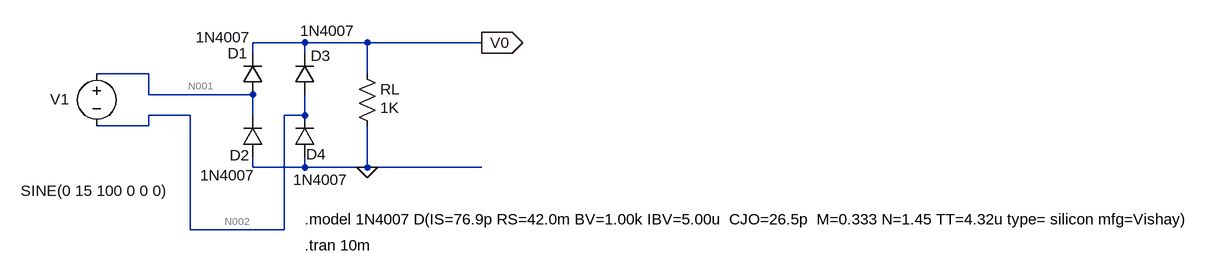
[diagram p0: schematic Bridge.asc]
Bridge.asc, the LTspice schematic file:
Version 4
SHEET 1 1500 680
WIRE 112 96 32 96
WIRE 208 96 112 96
WIRE 384 96 208 96
WIRE 32 112 32 96
WIRE 112 112 112 96
WIRE -128 144 -208 144
WIRE 208 144 208 96
WIRE -128 176 -128 144
WIRE 32 176 -128 176
WIRE -64 208 -128 208
WIRE 32 208 32 176
WIRE 112 208 112 176
WIRE 112 208 80 208
WIRE -128 224 -128 208
WIRE -128 224 -208 224
WIRE 32 288 32 272
WIRE 112 288 112 272
WIRE 112 288 32 288
WIRE 208 288 208 224
WIRE 208 288 112 288
WIRE 384 288 208 288
WIRE -64 384 -64 208
WIRE 80 384 80 208
WIRE 80 384 -64 384
FLAG 384 96 V0
IOPIN 384 96 Out
FLAG 208 288 0
SYMBOL diode 48 176 R180
WINDOW 0 24 64 Left 2
WINDOW 3 19 88 Left 2
SYMATTR InstName D1
SYMATTR Value 1N4007
SYMBOL diode 48 272 R180
WINDOW 0 21 3 Left 2
WINDOW 3 12 -28 Left 2
SYMATTR InstName D2
SYMATTR Value 1N4007
SYMBOL diode 128 176 R180
WINDOW 0 -24 60 Left 2
WINDOW 3 -62 98 Left 2
SYMATTR InstName D3
SYMATTR Value 1N4007
SYMBOL res 192 128 R0
WINDOW 3 36 68 Left 2
SYMATTR Value 1K
SYMATTR InstName RL
SYMATTR SpiceLine tol=1 pwr=0.1
SYMBOL voltage -208 128 R0
WINDOW 0 -72 55 Left 2
WINDOW 3 -117 196 Left 2
WINDOW 123 0 0 Left 2
WINDOW 39 0 0 Left 2
SYMATTR InstName V1
SYMATTR Value SINE(0 15 100 0 0 0)
SYMBOL diode 128 272 R180
WINDOW 0 -17 4 Left 2
WINDOW 3 -51 -35 Left 2
SYMATTR InstName D4
SYMATTR Value 1N4007
TEXT 112 368 Left 2 !.model 1N4007 D(IS=76.9p RS=42.0m BV=1.00k IBV=5.00u  CJO=26.5p  M=0.333 N=1.45 TT=4.32u type= silicon mfg=Vishay)
TEXT 112 408 Left 2 !.tran 10m

The netlist it stands for:
* Bridge.asc
D1 N001 V0 1N4007
D2 0 N001 1N4007
D3 N002 V0 1N4007
RL V0 0 1K tol=1 pwr=0.1
V1 N001 N002 SINE(0 15 100 0 0 0)
D4 0 N002 1N4007
.model D D
.lib standard.dio
.model 1N4007 D(IS=76.9p RS=42.0m BV=1.00k IBV=5.00u  CJO=26.5p  M=0.333 N=1.45 TT=4.32u type= silicon mfg=Vishay)
.tran 10m
.backanno
.end

* Results of the author's LTspice run, read from the files saved beside the schematic
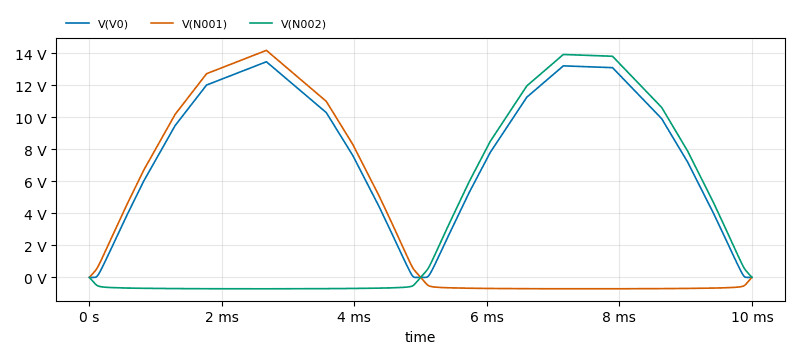
[diagram p1: Transient Analysis of Bridge.asc, plotted from the saved traces]
* Transient Analysis, 1 run:
*   V(V0): min -9.649 µV, max 13.48 V, average 8.079 V, rms 9.238 V, last -6.195 µV
*   V(N001): min -711.7 mV, max 14.19 V, average 4.027 V, rms 6.962 V, last 29.11 µV
*   V(N002): min -712.6 mV, max 13.93 V, average 4.052 V, rms 7.007 V, last 29.11 µV